# Altium schematic sheet 4_A real transistor.SchDoc
size A4; SheetNumber: 1; SheetTotal: 1; SPICEModelCacheCSPBSJPQ: <root> / <DocumentId>CSPBSJPQ</DocumentId> / <CacheFrame Number="0"> / <Model Name="bc846" Kind="MDL"> / <Text>.MODEL BC846 NPN(  BF=324.4 BR=8.29 CJC=3.347E-12 CJE=1.244E-11 FC=0.979 IKF=0.109 IKR=0.09 IRB=5E-06 IS=1.822E-14 ISC=9.982E-12 ISE=2.894E-16 ITF=0.3131 MJC=0.391 MJE=0.3656 MJS=0.333 NC=1.763 NE=1.4 NF=0.9932 NK=500M NR=0.9931 RB=10 RBM=5 RC=0.7014 RE=0.649 TF=4.908E-10 TR=9E-08 VAF=82 VAR=17.9 VJC=0.5463 VJE=0.7579 VTF=2.927 XCJC=0.6193 XTF=9.51 )</Text> / </Model> / </CacheFrame> / </root>
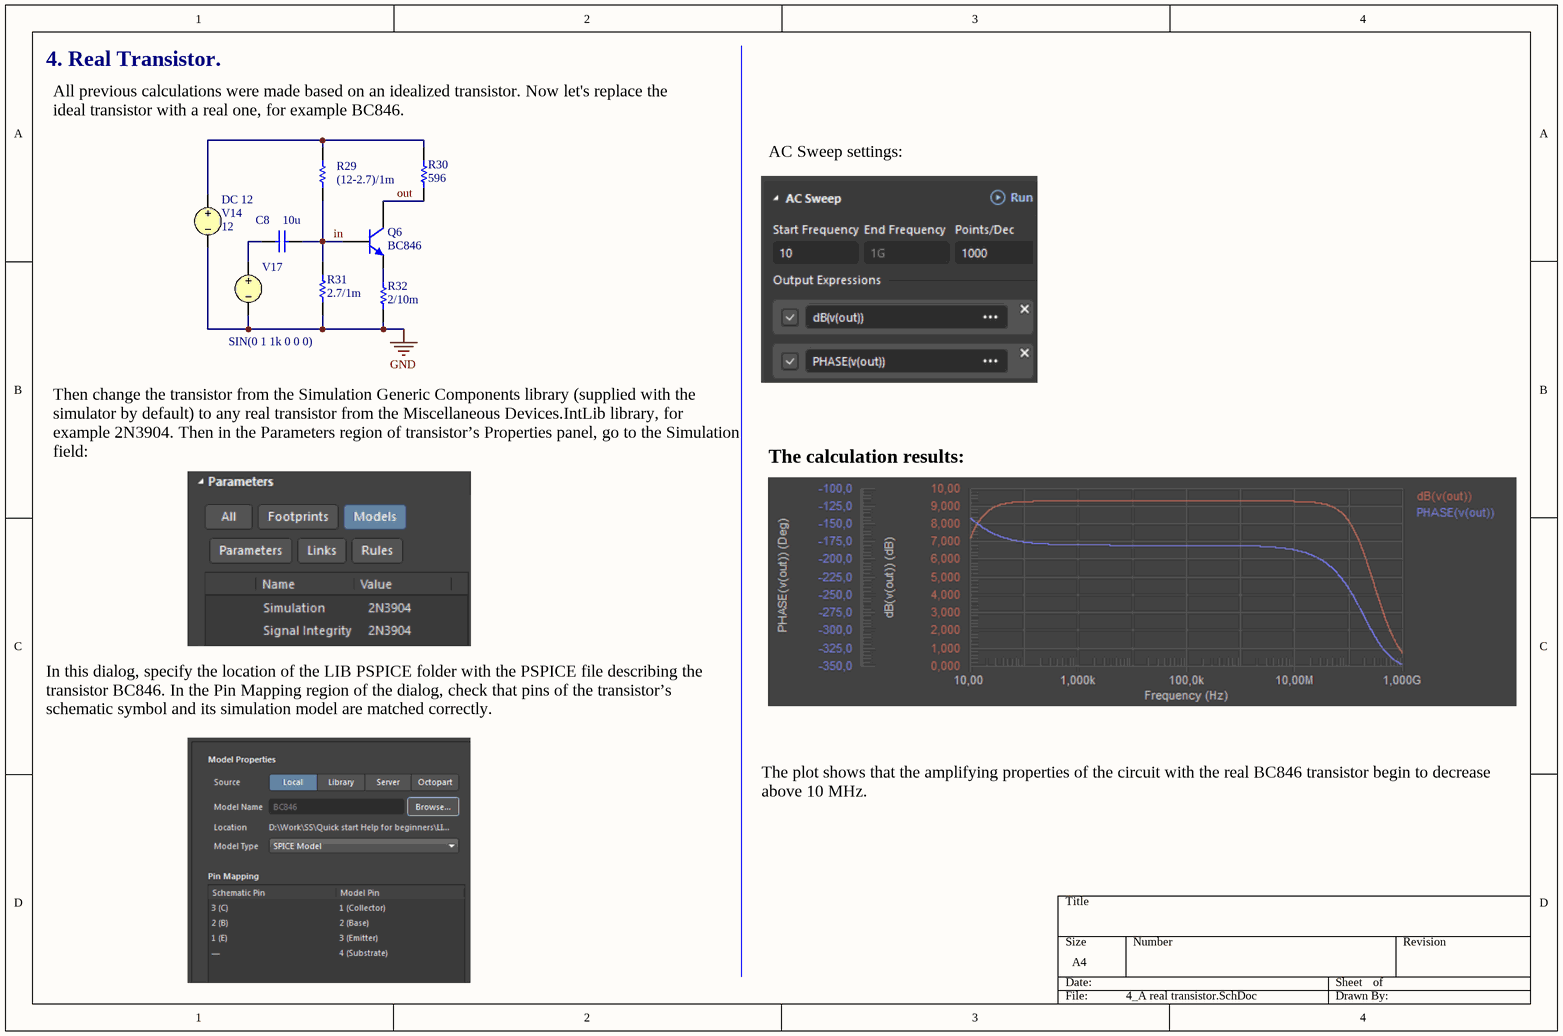
[diagram p0: 4_A real transistor.SchDoc]

## Parts
C8  value 10u  (hidden comment: Capacitor)
Q6  BC846  [TO-92A]
R29  value (12-2.7)/1m  (hidden comment: Resistor)
R30  value 596  (hidden comment: Resistor)
R31  value 2.7/1m  (hidden comment: Resistor)
R32  value 2/10m  (hidden comment: Resistor)
V14  DC 12  value 12
V17  SIN(0 1 1k 0 0 0)

## Nets
GND: R31.2 R32.1 V14.2 V17.2
in: C8.2 Q6.2(B) R29.1 R31.1
out: Q6.3(C) R30.1
Vcc: R29.2 R30.2 V14.1
NetC8_1: C8.1 V17.1
NetQ6_1: Q6.1(E) R32.2

## Notes on the sheet
- 4. Real Transistor.
- All previous calculations were made based on an idealized transistor. Now let's replace the ideal transistor with a real one, for example BC846.
- AC Sweep settings:
- Then change the transistor from the Simulation Generic Components library (supplied with the simulator by default) to any real transistor from the Miscellaneous Devices.IntLib library, for example 2N3904. Then in the Parameters region of transistor’s Properties panel, go to the Simulation field:
- The calculation results:
- In this dialog, specify the location of the LIB PSPICE folder with the PSPICE file describing the transistor BC846. In the Pin Mapping region of the dialog, check that pins of the transistor’s schematic symbol and its simulation model are matched correctly.
- The plot shows that the amplifying properties of the circuit with the real BC846 transistor begin to decrease above 10 MHz.

## Library data of the parts
C8 = Capacitor: SimulationGenericComponent: True
Q6 = 2N3904: NPN General Purpose Amplifier; Published: 8-Jun-2000; LatestRevisionDate: 15-Jan-2003; LatestRevisionNote: PCB Footprint 'BCY-W3/D4.7' replaced; DatasheetVersion: 1997; PackageVersion: Sep-1998; PackageReference: TO-92A; Publisher: Altium Limited; PackageDescription: TO, Flat Index; 3 In-Line, Axial Leads; Body Dia. 4.5mm; Leads 0.51 x 0.48 mm (max); ComponentLink1Description: Manufacturer Link; ComponentLink1URL: http://www.fairchildsemi.com/; ComponentLink2Description: Datasheet; ComponentLink2URL: http://www.fairchildsemi.com/ds/2N%2F2N3904.pdf
V14 = VSRC: Voltage Source; Note: PCB Footprint - Not required; AC Magnitude: 0; Published: 30-July-2020; LatestRevisionDate: 30-July-2020; LatestRevisionNote: Re-released for DXP Platform.; PackageReference: Not Applicable; Publisher: Altium Limited
V17 = VSRC: Voltage Source; Note: PCB Footprint - Not required; DC Magnitude: 0; AC Magnitude: 1; Published: 30-July-2020; LatestRevisionDate: 30-July-2020; LatestRevisionNote: Re-released for DXP Platform.; PackageReference: Not Applicable; Publisher: Altium Limited; Offset: 0; Amplitude: 1; Frequency: 1k; Delay: 0; Damping Factor: 0; Phase: 0